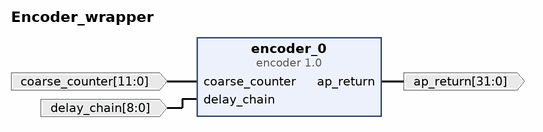
[diagram p0: block diagram of the top level]
# Vivado block design Encoder_wrapper, xc7a35tcpg236-1, Vivado 2023.2
create_bd_design Encoder_wrapper

create_bd_port -dir O -from 31 -to 0 -type data ap_return
create_bd_port -dir I -from 11 -to 0 -type data coarse_counter
create_bd_port -dir I -from 8 -to 0 delay_chain

create_bd_cell -type ip -vlnv xilinx.com:hls:encoder:1.0 encoder_0

# ---- connections ----

connect_bd_net [get_bd_ports coarse_counter] [get_bd_pins encoder_0/coarse_counter]
connect_bd_net [get_bd_ports delay_chain] [get_bd_pins encoder_0/delay_chain]
connect_bd_net [get_bd_pins encoder_0/ap_return] [get_bd_ports ap_return]

validate_bd_design
save_bd_design
